# EAGLE design 44con2014 (EAGLE 6.5.0)
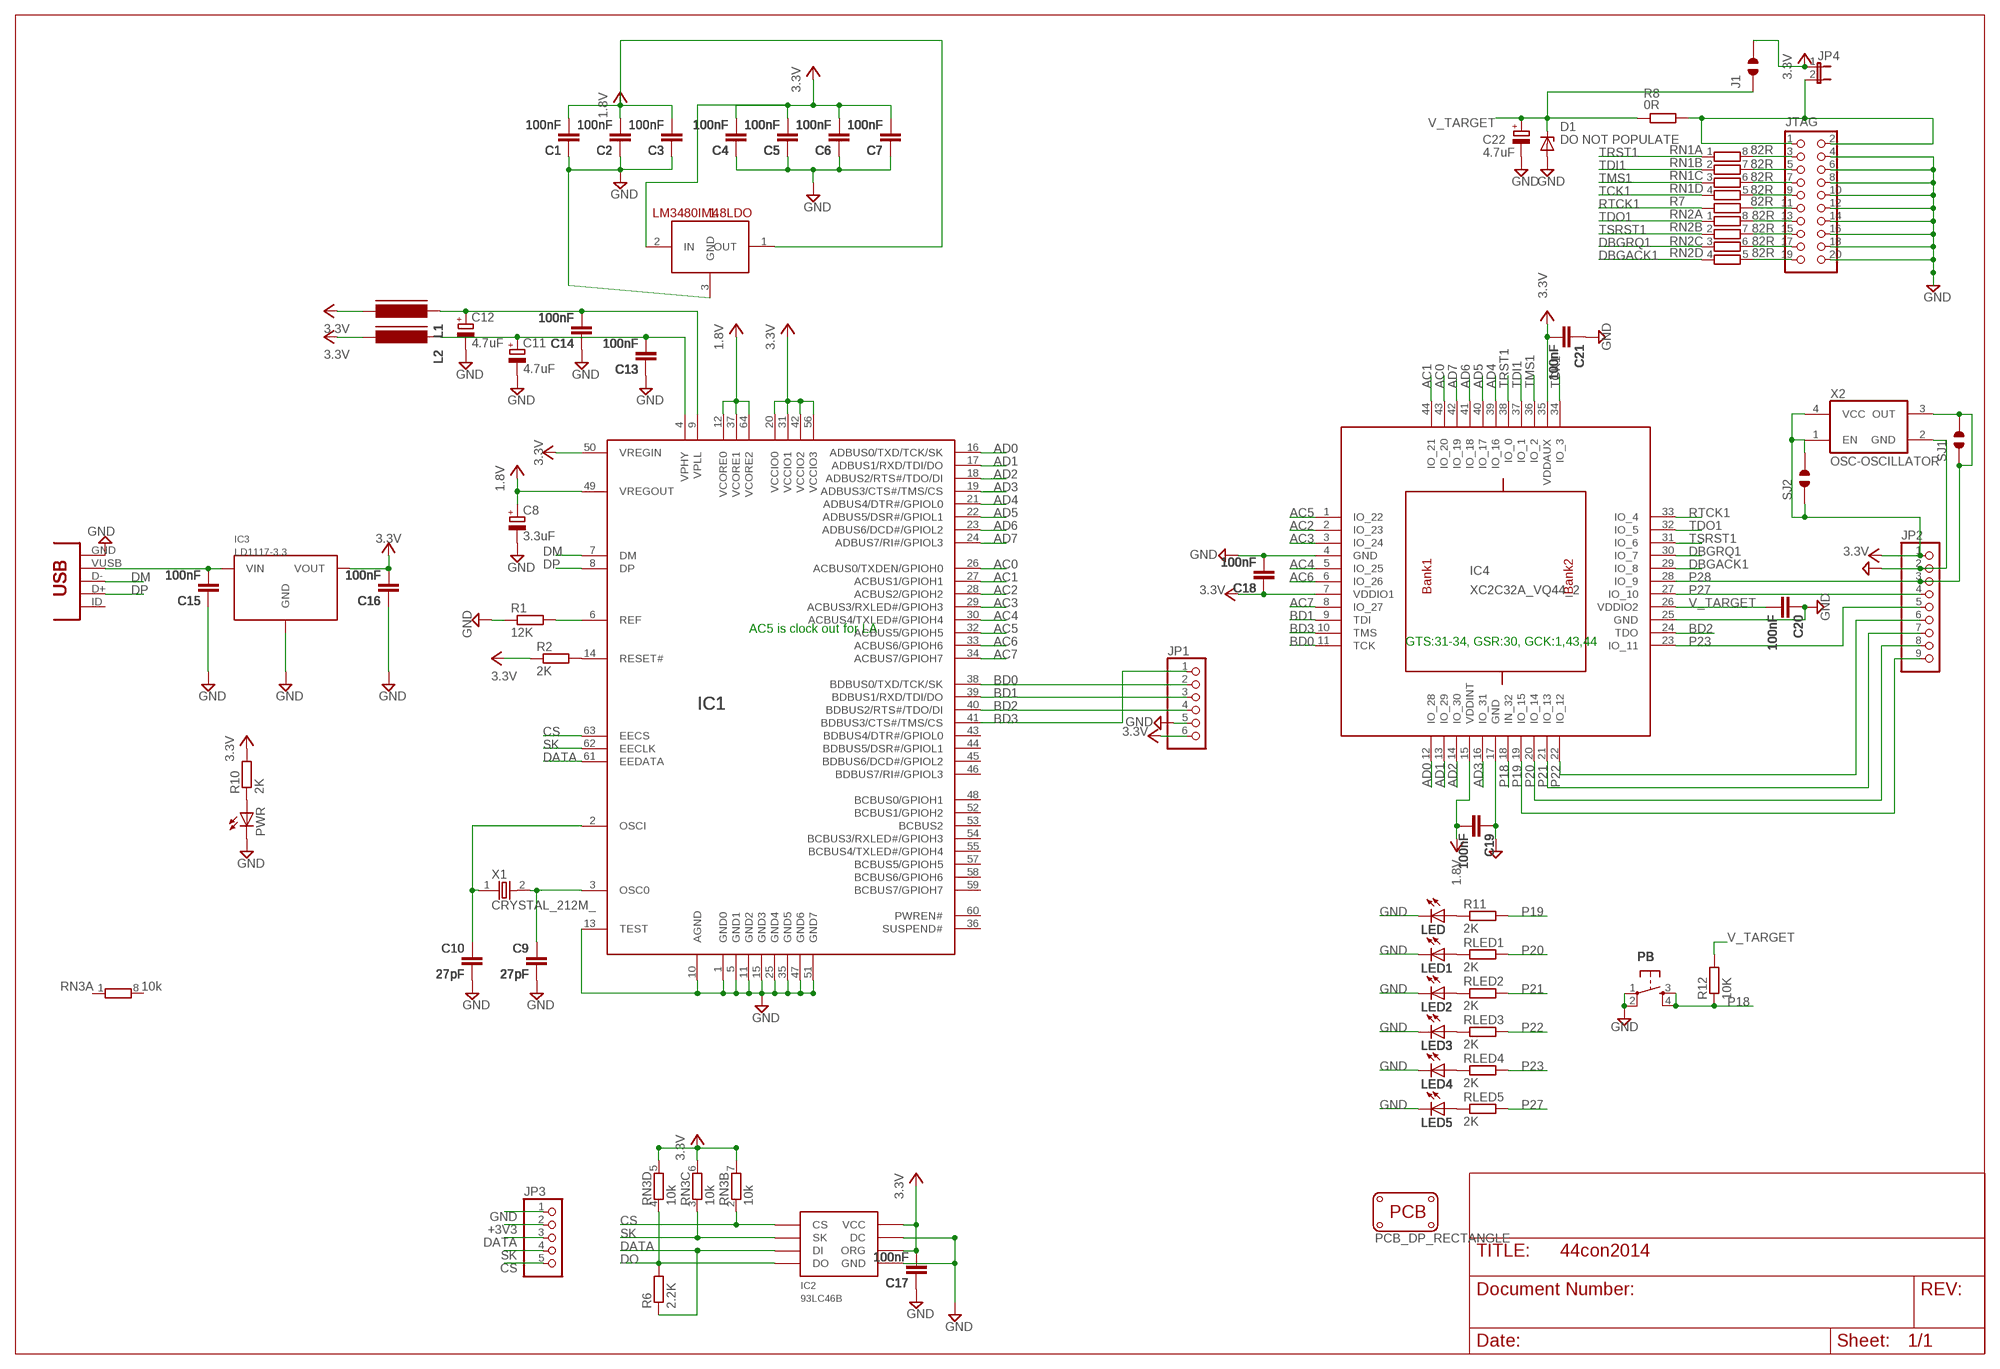
[diagram p0: schematic, sheet 1]

## Parts
1.8LDO  LM3480IM4  [SOT23-3]
C1  100nF  CAPC603  [C603]
C2  100nF  CAPC603  [C603]
C3  100nF  CAPC603  [C603]
C4  100nF  CAPC603  [C603]
C5  100nF  CAPC603  [C603]
C6  100nF  CAPC603  [C603]
C7  100nF  CAPC603  [C603]
C8  3.3uF  CAP_POLSMC_A  [SMC_A]
C9  27pF  CAPC603  [C603]
C10  27pF  CAPC603  [C603]
C11  4.7uF  CAP_POLSMC_A  [SMC_A]
C12  4.7uF  CAP_POLSMC_A  [SMC_A]
C13  100nF  CAPC603  [C603]
C14  100nF  CAPC603  [C603]
C15  100nF  CAPC603  [C603]
C16  100nF  CAPC603  [C603]
C17  100nF  CAPC603  [C603]
C18  100nF  CAPC603  [C603]
C19  100nF  CAPC603  [C603]
C20  100nF  CAPC603  [C603]
C21  100nF  CAPC603  [C603]
C22  4.7uF  CAP_POLSMC_A  [SMC_A]
D1  DO NOT POPULATE  ZENERSOD-123  [SOD-123]
IC1  FT2232H  [LQFP64]
IC2  93LC46B  93C46  [SOIC8]
IC3  LD1117-3.3  [SOT223]
IC4  XC2C32A_VQ44_2  [VQ44]
J1  JUMPER_SOLDER_1X2  [JUMPER_SOLDER_1X2]
JP1  PINHD-1X6  [1X06]
JP2  PINHD-1X9  [1X09]
JP3  PINHD-1X5  [1X05]
JP4  JP1EJP  [1X02]
JTAG  CON_HEADER_2X10-SHROUDED  [PINSHRD_PTH_2X10]
L1  FERRITE_BEAD603  [FB603]
L2  FERRITE_BEAD603  [FB603]
LED  LED805  [LED-805]
LED1  LED805  [LED-805]
LED2  LED805  [LED-805]
LED3  LED805  [LED-805]
LED4  LED805  [LED-805]
LED5  LED805  [LED-805]
PB  SW-SMD-SMALL  [TACT_SWITCH_SMALL]
PCB3  PCB_DP_RECTANGLE  [44CON2014]
PWR  LEDCHIPLED_0805  [CHIPLED_0805]
R1  12K  RESISTORR603  [R603]
R2  2K  RESISTORR603  [R603]
R6  2.2K  RESISTORR603  [R603]
R7  82R  RESISTORR603  [R603]
R8  0R  RESISTORR1206  [R1206]
R10  2K  RESISTORR603  [R603]
R11  2K  RESISTORR603  [R603]
R12  10K  RESISTORR603  [R603]
RLED1  2K  RESISTORR603  [R603]
RLED2  2K  RESISTORR603  [R603]
RLED3  2K  RESISTORR603  [R603]
RLED4  2K  RESISTORR603  [R603]
RLED5  2K  RESISTORR603  [R603]
RN1  82R  RNETWORK  [RN8P-4R-CRA06S]
RN2  82R  RNETWORK  [RN8P-4R-CRA06S]
RN3  10k  RNETWORK  [RN8P-4R-CRA06S]
SJ1  JUMPER_SOLDER_1X2  [JUMPER_SOLDER_1X2]
SJ2  JUMPER_SOLDER_1X2  [JUMPER_SOLDER_1X2]
USB  CON-USB-MINI-BUSB1  [CONN_USB_MINI-B]
X1  CRYSTAL_212M_  OSC-XTAL-12M  [XTAL_4X6]
X2  OSC-OSCILLATOR  [OSCILLATOR_7X5_SMD]

## Nets
1.8V: 1.8LDO.1(OUT) C1.2 C2.2 C3.2 C8.+ C19.2 IC1.12(VCORE0) IC1.37(VCORE1) IC1.49(VREGOUT) IC1.64(VCORE2) IC4.15(VDDINT)
+3V3: 1.8LDO.2(IN) C4.2 C5.2 C6.2 C7.2 C16.2 C17.2 C18.1 C21.2 IC1.20(VCCIO0) IC1.31(VCCIO1) IC1.42(VCCIO2) IC1.50(VREGIN) IC1.56(VCCIO3) IC2.6(ORG) IC2.8(VCC) IC3.2(VOUT) IC4.7(VDDIO1) IC4.35(VDDAUX) J1.2 JP1.6 JP2.1 JP3.2 JP4.1 L1.2 L2.2 R2.1 R10.2 RN3.5 RN3.6 RN3.7 SJ2.1 SJ2.2 X2.1(EN) X2.4(VCC) ; supply symbol labelled 3.3V
AC0: IC1.26(ACBUS0/TXDEN/GPIOH0) IC4.43(IO_20)
AC1: IC1.27(ACBUS1/GPIOH1) IC4.44(IO_21)
AC2: IC1.28(ACBUS2/GPIOH2) IC4.2(IO_23)
AC3: IC1.29(ACBUS3/RXLED#/GPIOH3) IC4.3(IO_24)
AC4: IC1.30(ACBUS4/TXLED#/GPIOH4) IC4.5(IO_25)
AC5: IC1.32(ACBUS5/GPIOH5) IC4.1(IO_22)
AC6: IC1.33(ACBUS6/GPIOH6) IC4.6(IO_26)
AC7: IC1.34(ACBUS7/GPIOH7) IC4.8(IO_27)
AD0: IC1.16(ADBUS0/TXD/TCK/SK) IC4.12(IO_28)
AD1: IC1.17(ADBUS1/RXD/TDI/DO) IC4.13(IO_29)
AD2: IC1.18(ADBUS2/RTS#/TDO/DI) IC4.14(IO_30)
AD3: IC1.19(ADBUS3/CTS#/TMS/CS) IC4.16(IO_31)
AD4: IC1.21(ADBUS4/DTR#/GPIOL0) IC4.39(IO_16)
AD5: IC1.22(ADBUS5/DSR#/GPIOL1) IC4.40(IO_17)
AD6: IC1.23(ADBUS6/DCD#/GPIOL2) IC4.41(IO_18)
AD7: IC1.24(ADBUS7/RI#/GPIOL3) IC4.42(IO_19)
BD0: IC1.38(BDBUS0/TXD/TCK/SK) IC4.11(TCK) JP1.2
BD1: IC1.39(BDBUS1/RXD/TDI/DO) IC4.9(TDI) JP1.3
BD2: IC1.40(BDBUS2/RTS#/TDO/DI) IC4.24(TDO) JP1.4
BD3: IC1.41(BDBUS3/CTS#/TMS/CS) IC4.10(TMS) JP1.1
CS: IC1.63(EECS) IC2.1(CS) JP3.5 RN3.2
DATA: IC1.61(EEDATA) IC2.3(DI) JP3.3 R6.1
DBGACK1: IC4.29(IO_8) RN2.4
DBGRQ1: IC4.30(IO_7) RN2.3
DM: IC1.7(DM) USB.D-
DO: IC2.4(DO) R6.2 RN3.4
DP: IC1.8(DP) USB.D+
GND: 1.8LDO.3(GND) C1.1 C2.1 C3.1 C4.1 C5.1 C6.1 C7.1 C8.- C9.2 C10.2 C11.- C12.- C13.1 C14.1 C15.1 C16.1 C17.1 C18.2 C19.1 C20.1 C21.1 C22.- D1.A IC1.1(GND0) IC1.5(GND1) IC1.10(AGND) IC1.11(GND2) IC1.13(TEST) IC1.15(GND3) IC1.25(GND4) IC1.35(GND5) IC1.47(GND6) IC1.51(GND7) IC2.5(GND) IC2.7(DC) IC3.1(GND) IC4.4(GND) IC4.17(GND) IC4.25(GND) JP1.5 JP2.2 JP3.1 JTAG.4 JTAG.6 JTAG.8 JTAG.10 JTAG.12 JTAG.14 JTAG.16 JTAG.18 JTAG.20 LED1.C LED2.C LED3.C LED4.C LED5.C LED.C PB.1 PB.2 PWR.C R1.1 USB.GND X2.2(GND)
N$1: C9.1 IC1.3(OSC0) X1.2
N$2: C10.1 IC1.2(OSCI) X1.1
N$3: IC1.14(RESET#) R2.2
N$4: IC1.6(REF) R1.2
N$5: C15.2 IC3.3(VIN) USB.VUSB
N$6: PWR.A R10.1
N$7: JTAG.3 RN1.8
N$8: LED.A R11.1
N$9: JTAG.5 RN1.7
N$10: JTAG.7 RN1.6
N$11: JTAG.9 RN1.5
N$12: JTAG.11 R7.2
N$13: JTAG.13 RN2.8
N$14: JTAG.15 RN2.7
N$15: JTAG.17 RN2.6
N$16: JTAG.19 RN2.5
N$22: LED1.A RLED1.1
N$23: LED2.A RLED2.1
N$24: LED3.A RLED3.1
N$25: LED4.A RLED4.1
N$26: LED5.A RLED5.1
P18: IC4.18(IN_32) PB.3 PB.4 R12.1
P19: IC4.19(IO_15) JP2.9 R11.2
P20: IC4.20(IO_14) JP2.8 RLED1.2
P21: IC4.21(IO_13) JP2.7 RLED2.2
P22: IC4.22(IO_12) JP2.6 RLED3.2
P23: IC4.23(IO_11) JP2.5 RLED4.2
P27: IC4.27(IO_10) JP2.4 RLED5.2
P28: IC4.28(IO_9) JP2.3 SJ1.1 SJ1.2 X2.3(OUT)
RTCK1: IC4.33(IO_4) R7.1
SK: IC1.62(EECLK) IC2.2(SK) JP3.4 RN3.3
TCK1: IC4.34(IO_3) RN1.4
TDI1: IC4.37(IO_1) RN1.2
TDO1: IC4.32(IO_5) RN2.1
TMS1: IC4.36(IO_2) RN1.3
TRST1: IC4.38(IO_0) RN1.1
TSRST1: IC4.31(IO_6) RN2.2
V_TARGET: C20.2 C22.+ D1.C IC4.26(VDDIO2) J1.1 R8.1 R12.2
V_TARGET_UNREG: JP4.2 JTAG.1 JTAG.2 R8.2
VPHY: C11.+ C13.2 IC1.4(VPHY) L2.1
VPLL: C12.+ C14.2 IC1.9(VPLL) L1.1
Unconnected: IC1.36(SUSPEND#) IC1.43(BDBUS4/DTR#/GPIOL0) IC1.44(BDBUS5/DSR#/GPIOL1) IC1.45(BDBUS6/DCD#/GPIOL2) IC1.46(BDBUS7/RI#/GPIOL3) IC1.48(BCBUS0/GPIOH1) IC1.52(BCBUS1/GPIOH2) IC1.53(BCBUS2) IC1.54(BCBUS3/RXLED#/GPIOH3) IC1.55(BCBUS4/TXLED#/GPIOH4) IC1.57(BCBUS5/GPIOH5) IC1.58(BCBUS6/GPIOH6) IC1.59(BCBUS7/GPIOH7) IC1.60(PWREN#) RN3.1 RN3.8 USB.BODY@1(BODY) USB.BODY@2(BODY) USB.BODY@3(BODY) USB.BODY@4(BODY) USB.ID(USBID)

## Notes on the sheet
- AC5 is clock out for LA
- GTS:31-34, GSR:30, GCK:1,43,44

## Library data of the parts
1.8LDO = SparkFun-PowerIC:LM3480IM4: Small package linear regulator
C1-C7 C9 C10 C13-C21 = dp_devices:CAP
C8 C11 C12 C22 = DP-EagleLibrary:CAP_POL
D1 = dp_devices:ZENER: Zener Diode SOD-323
IC1 = dp_devices:FT2232H: DUAL HIGH SPEED USB TO MULTIPURPOSE UART/FIFO IC
IC2 = DP-EagleLibrary:93C46
IC3 = DP-EagleLibrary:LD1117-3.3
IC4 = dp_devices:XC2C32A_VQ44_2: xc2c32a_vq44-ian edit this description Auto generated by make-symbol-device-package-bsdl.ulp Rev. 29 Source: xc2c32a_vq44-ian.bsd
J1 SJ1 SJ2 = dp_devices:JUMPER_SOLDER_1X2
JP1 = pinhead:PINHD-1X6: PIN HEADER
JP2 = pinhead - Copy:PINHD-1X9: PIN HEADER
JP3 = pinhead:PINHD-1X5: PIN HEADER
JP4 = jumper:JP1E: JUMPER
JTAG = dp_devices:CON_HEADER_2X10
L1 L2 = dp_devices:FERRITE_BEAD
LED LED1-LED5 = dp_devices:LED
PB = dp_devices:SW-SMD-SMALL
PCB3 = dp_pcb:PCB_DP_RECTANGLE: Dangerous Prototypes Standard Rectangular PCB sizes
PWR = led:LED: LED OSRAM: - CHIPLED LG R971, LG N971, LY N971, LG Q971, LY Q971, LO R971, LY R971 LH N974, LH R974 LS Q976, LO Q976, LY Q976 LO Q996 - Hyper CHIPLED LW Q18S LB Q993, LB Q99A, LB R99A - SideLED LS A670, LO A670, LY A670, LG A670, LP A670 LB A673, LV A673, LT A673, LW A673 LH A674 LY A675 LS A676, LA A676, LO A676, LY A676, LW A676 LS A679, LY A679, LG A679 - Hyper Micro SIDELED® LS Y876, LA Y876, LO Y876, LY Y876 LT Y87S - SmartLED LW L88C, LW L88S LB L89C, LB L89S, LG L890 LS L89K, LO L89K, LY L89K LS L896, LA L896, LO L896, LY L896 - TOPLED LS T670, LO T670, LY T670, LG T670, LP T670 LSG T670, LSP T670, LSY T670, LOP T670, LYG T670 LG T671, LOG T671, LSG T671 LB T673, LV T673, LT T673, LW T673 LH T674 LS T676, LA T676, LO T676, LY T676, LB T676, LH T676, LSB T676, LW T676 LB T67C, LV T67C, LT T67C, LS T67K, LO T67K, LY T67K, LW E67C LS E67B, LA E67B, LO E67B, LY E67B, LB E67C, LV E67C, LT E67C LW T67C LS T679, LY T679, LG T679 LS T770, LO T770, LY T770, LG T770, LP T770 LB T773, LV T773, LT T773, LW T773 LH T774 LS E675, LA E675, LY E675, LS T675 LS T776, LA T776, LO T776, LY T776, LB T776 LHGB T686 LT T68C, LB T68C - Hyper Mini TOPLED® LB M676 - Mini TOPLED Santana® LG M470 LS M47K, LO M47K, LY M47K Source: http://www.osram.convergy.de LUXEON: - LUMILED® LXK2-PW12-R00, LXK2-PW12-S00, LXK2-PW14-U00, LXK2-PW14-V00 LXK2-PM12-R00, LXK2-PM12-S00, LXK2-PM14-U00 LXK2-PE12-Q00, LXK2-PE12-R00, LXK2-PE12-S00, LXK2-PE14-T00, LXK2-PE14-U00 LXK2-PB12-K00, LXK2-PB12-L00, LXK2-PB12-M00, LXK2-PB14-N00, LXK2-PB14-P00, LXK2-PB14-Q00 LXK2-PR12-L00, LXK2-PR12-M00, LXK2-PR14-Q00, LXK2-PR14-R00 LXK2-PD12-Q00, LXK2-PD12-R00, LXK2-PD12-S00 LXK2-PH12-R00, LXK2-PH12-S00 LXK2-PL12-P00, LXK2-PL12-Q00, LXK2-PL12-R00 Source: www.luxeon.com KINGBRIGHT: KA-3528ASYC Source: www.kingbright.com
R1 R2 R6-R8 R10-R12 RLED1-RLED5 = dp_devices:RESISTOR
RN1-RN3 = dp_devices:RNETWORK: 4 Resistor Array 0603
USB = dp_devices:CON-USB-MINI-B: USB connector
X1 = dp_devices:OSC-XTAL
X2 = dp_devices:OSC-OSCILLATOR: Oscillator

## Board
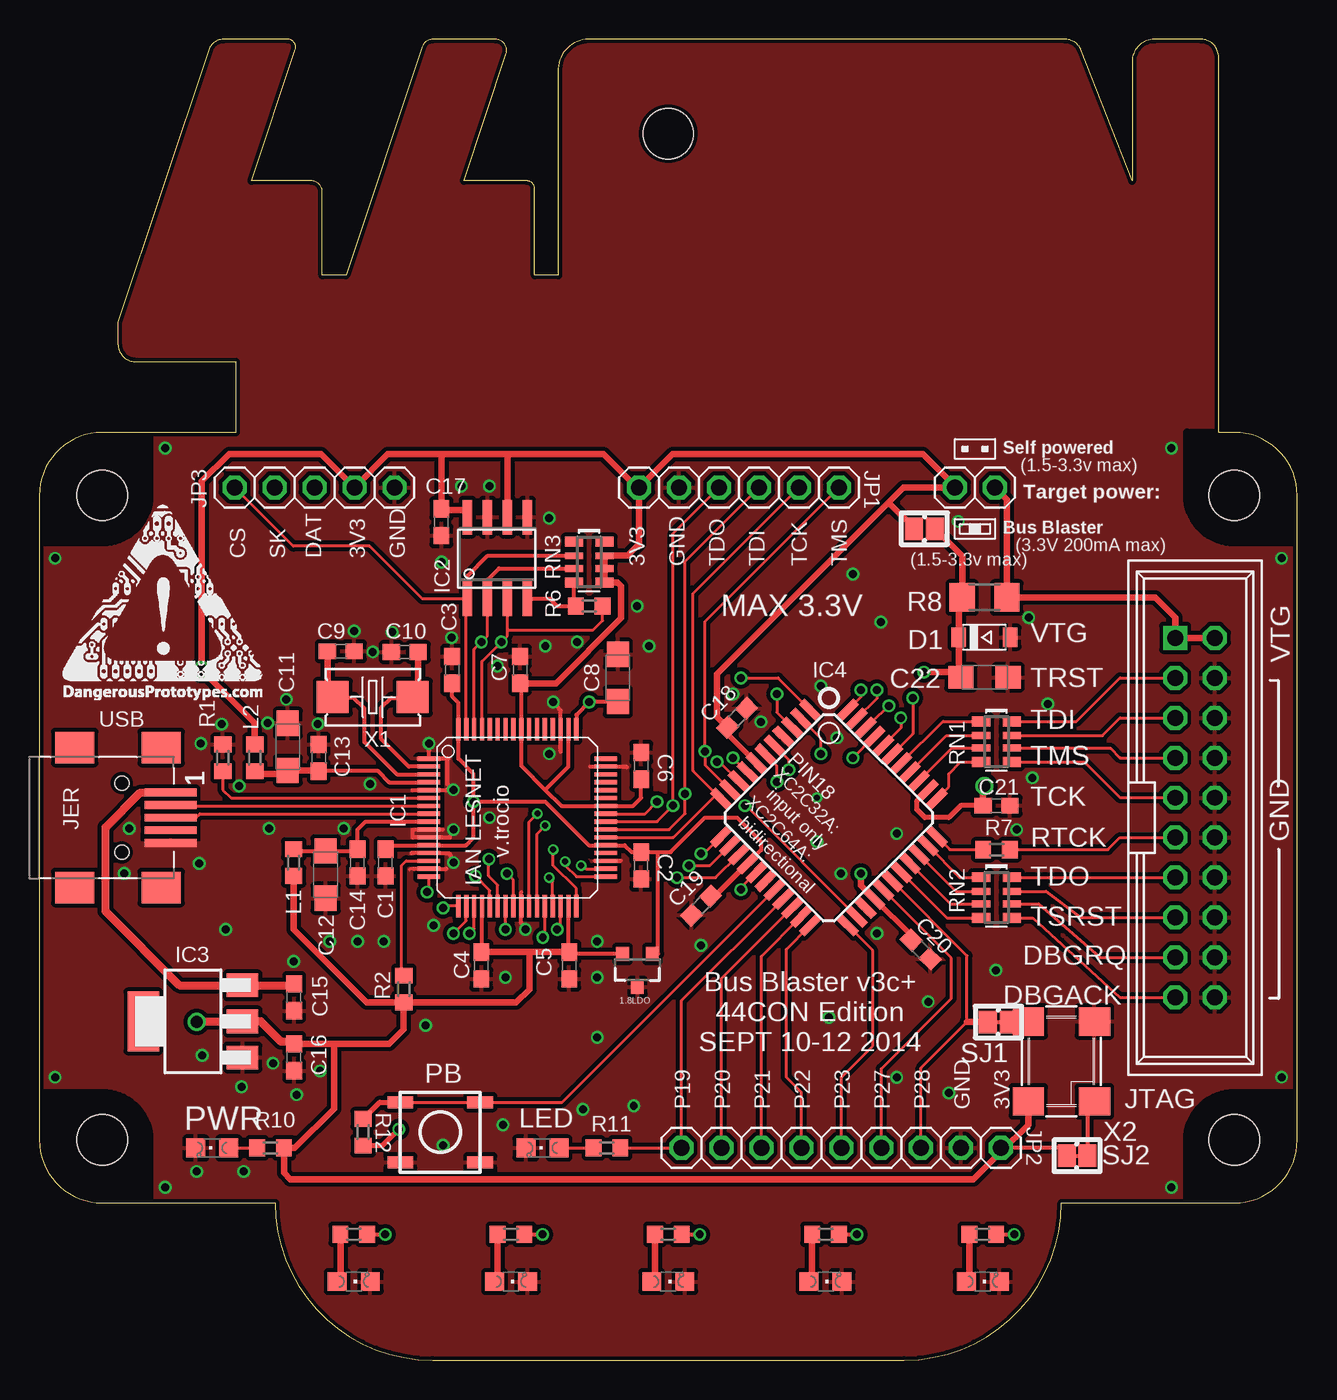
[diagram p1: board, top side]
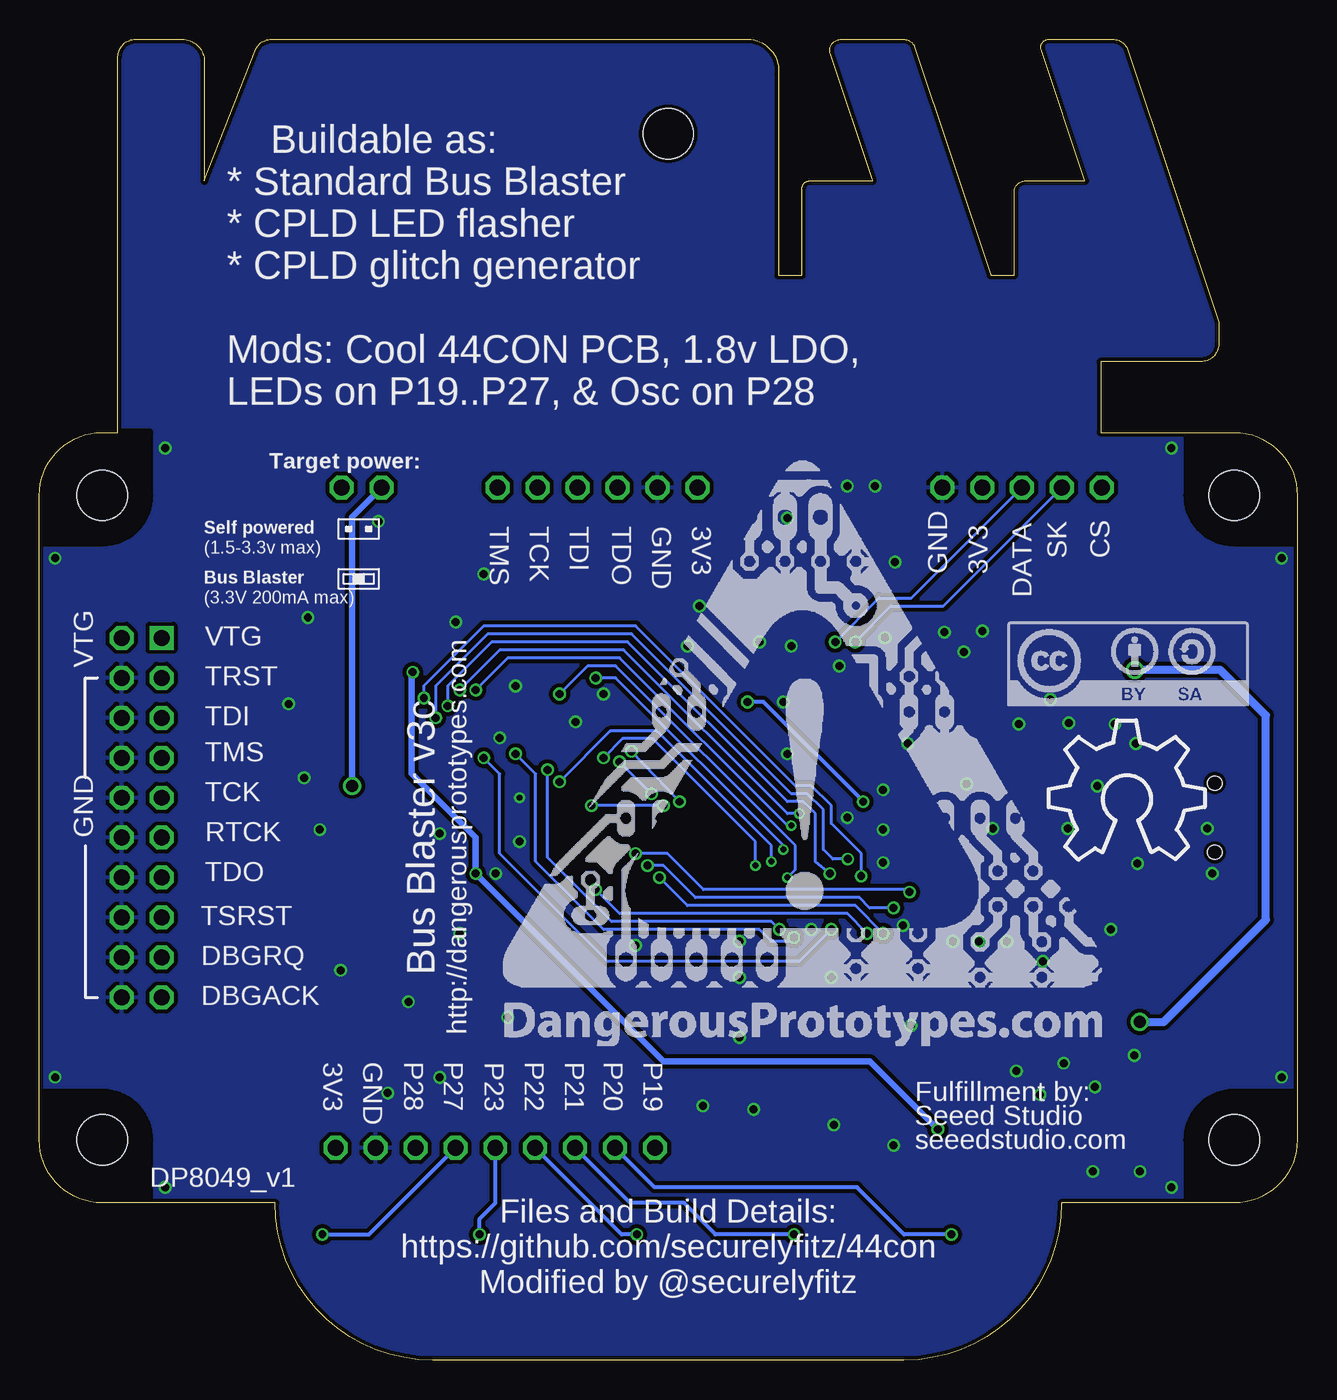
[diagram p2: board, bottom side, seen from below]

Size 80 x 84 mm. Coordinates in mm from the lower left corner, seen from the top.
Copper layers (1*16): Top 0.035mm / dielectric 1.5mm / Bottom 0.035mm
Design rules "Fusion_eagle_rule_v1.1": minimum track width 6mil, minimum drill 12mil, track to track 6mil, track to pad 6mil, pad to pad 6mil, via to via 6mil, smd to smd 0mil, copper to edge 10mil, drill to drill 10mil, minimum pad ring 10mil, minimum via ring 6mil, stop-mask expansion 2mil, vias tented up to drill 100mil, thermal gap 10mil
Holes 3.2 mm at 40,78

### Footprints (pad centres in the part's own frame; a part is rotated, then mirrored left to right if it is on the bottom)
SOT23-3 = smd 0.8 x 0.9: 1 -0.95,-1; 2 0.95,-1; 3 0,1.1
C603 = smd 1.1 x 1: 1 -0.85,0; 2 0.85,0
SMC_A = smd 1.6 x 1.4: + -1.5,0; - 1.5,0
SOD-123 = smd 0.91 x 1.22: A 1.635,0; C -1.635,0
LQFP64 = smd 1.45 x 0.27: 1 -5.625,3.75; 2 -5.625,3.25; 3 -5.625,2.75; 4 -5.625,2.25; 5 -5.625,1.75; 6 -5.625,1.25; 7 -5.625,0.75; 8 -5.625,0.25; 9 -5.625,-0.25; 10 -5.625,-0.75; 11 -5.625,-1.25; 12 -5.625,-1.75; 13 -5.625,-2.25; 14 -5.625,-2.75; 15 -5.625,-3.25; 16 -5.625,-3.75; 33 5.625,-3.75; 34 5.625,-3.25; 35 5.625,-2.75; 36 5.625,-2.25; 37 5.625,-1.75; 38 5.625,-1.25; 39 5.625,-0.75; 40 5.625,-0.25; 41 5.625,0.25; 42 5.625,0.75; 43 5.625,1.25; 44 5.625,1.75; 45 5.625,2.25; 46 5.625,2.75; 47 5.625,3.25; 48 5.625,3.75 | smd 0.27 x 1.45: 17 -3.75,-5.625; 18 -3.25,-5.625; 19 -2.75,-5.625; 20 -2.25,-5.625; 21 -1.75,-5.625; 22 -1.25,-5.625; 23 -0.75,-5.625; 24 -0.25,-5.625; 25 0.25,-5.625; 26 0.75,-5.625; 27 1.25,-5.625; 28 1.75,-5.625; 29 2.25,-5.625; 30 2.75,-5.625; 31 3.25,-5.625; 32 3.75,-5.625; 49 3.75,5.625; 50 3.25,5.625; 51 2.75,5.625; 52 2.25,5.625; 53 1.75,5.625; 54 1.25,5.625; 55 0.75,5.625; 56 0.25,5.625; 57 -0.25,5.625; 58 -0.75,5.625; 59 -1.25,5.625; 60 -1.75,5.625; 61 -2.25,5.625; 62 -2.75,5.625; 63 -3.25,5.625; 64 -3.75,5.625
SOIC8 = smd 0.6 x 2.2: 1 -1.905,-2.6; 2 -0.635,-2.6; 3 0.635,-2.6; 4 1.905,-2.6; 5 1.905,2.6; 6 0.635,2.6; 7 -0.635,2.6; 8 -1.905,2.6
SOT223 = smd 1.5 x 2: 1 -2.3,-3.15; 2 0,-3.15; 3 2.3,-3.15 | smd 3.8 x 2: 4 0,3.15
VQ44 = smd 1.5 x 0.5: 1 -5.7,4; 2 -5.7,3.2; 3 -5.7,2.4; 4 -5.7,1.6; 5 -5.7,0.8; 6 -5.7,0; 7 -5.7,-0.8; 8 -5.7,-1.6; 9 -5.7,-2.4; 10 -5.7,-3.2; 11 -5.7,-4; 23 5.7,-4; 24 5.7,-3.2; 25 5.7,-2.4; 26 5.7,-1.6; 27 5.7,-0.8; 28 5.7,0; 29 5.7,0.8; 30 5.7,1.6; 31 5.7,2.4; 32 5.7,3.2; 33 5.7,4 | smd 0.5 x 1.5: 12 -4,-5.7; 13 -3.2,-5.7; 14 -2.4,-5.7; 15 -1.6,-5.7; 16 -0.8,-5.7; 17 0,-5.7; 18 0.8,-5.7; 19 1.6,-5.7; 20 2.4,-5.7; 21 3.2,-5.7; 22 4,-5.7; 34 4,5.7; 35 3.2,5.7; 36 2.4,5.7; 37 1.6,5.7; 38 0.8,5.7; 39 0,5.7; 40 -0.8,5.7; 41 -1.6,5.7; 42 -2.4,5.7; 43 -3.2,5.7; 44 -4,5.7
JUMPER_SOLDER_1X2 = smd 1.143 x 1.422: 1 -0.66,0; 2 0.66,0
1X06 = drill 1.016 octagon: 1 -6.35,0; 2 -3.81,0; 3 -1.27,0; 4 1.27,0; 5 3.81,0; 6 6.35,0
1X09 = drill 1.016 octagon: 1 -10.16,0; 2 -7.62,0; 3 -5.08,0; 4 -2.54,0; 5 0,0; 6 2.54,0; 7 5.08,0; 8 7.62,0; 9 10.16,0
1X05 = drill 1.016 octagon: 1 -5.08,0; 2 -2.54,0; 3 0,0; 4 2.54,0; 5 5.08,0
1X02 = drill 1.016 octagon: 1 -1.27,0; 2 1.27,0
PINSHRD_PTH_2X10 = drill 1.016 square: 1 -11.43,-1.27 | drill 1.016 octagon: 2 -11.43,1.27; 3 -8.89,-1.27; 4 -8.89,1.27; 5 -6.35,-1.27; 6 -6.35,1.27; 7 -3.81,-1.27; 8 -3.81,1.27; 9 -1.27,-1.27; 10 -1.27,1.27; 11 1.27,-1.27; 12 1.27,1.27; 13 3.81,-1.27; 14 3.81,1.27; 15 6.35,-1.27; 16 6.35,1.27; 17 8.89,-1.27; 18 8.89,1.27; 19 11.43,-1.27; 20 11.43,1.27
FB603 = smd 1 x 1.1: 1 -0.85,0; 2 0.85,0
LED-805 = smd 1.2 x 1.2: A 0,-1.05; C 0,1.05
TACT_SWITCH_SMALL = smd 1.651 x 0.762: 1 -2.54,1.905; 2 2.54,1.905; 3 -2.54,-1.905; 4 2.54,-1.905
44CON2014 = hole 3.2: 4,4; 76,4; 76,45; 4,45
CHIPLED_0805 = smd 1.2 x 1.2: A 0,-1.05; C 0,1.05
R603 = smd 1 x 1.1: 1 -0.85,0; 2 0.85,0
R1206 = smd 1.6 x 1.803: 1 -1.422,0; 2 1.422,0
RN8P-4R-CRA06S = smd 0.63 x 1.15: 1 -1.295,-0.975; 4 1.295,-0.975; 5 1.295,0.975; 8 -1.295,0.975 | smd 0.44 x 1.15: 2 -0.4,-0.975; 3 0.4,-0.975; 6 0.4,0.975; 7 -0.4,0.975
CONN_USB_MINI-B = smd 2 x 2.5: BODY@1 -4.45,2.5; BODY@2 4.45,2.5; BODY@3 4.45,-3; BODY@4 -4.45,-3 | smd 0.5 x 3.3: D+ 0,3.1; D- -0.8,3.1; GND 1.6,3.1; ID 0.8,3.1; VUSB -1.6,3.1 | hole 0.9: -2.2,0; 2.2,0
XTAL_4X6 = smd 2.032 x 2.032: 1 -2.54,0; 2 2.54,0
OSCILLATOR_7X5_SMD = smd 1.8 x 2: 1 -2.54,-2.1; 2 2.54,-2.1; 3 2.54,2.1; 4 -2.54,2.1

### Placement (x,y rotation side)
1.8LDO  38.04,24.84 180 top
C1  22.02,31.64 90 top
C2  38.27,31.46 90 top
C3  26.26,43.9 270 top
C4  28.11,25.1 90 top
C5  33.7,25.1 90 top
C6  38.27,37.8 270 top
C7  30.57,43.9 270 top
C8  36.8,43.39 90 top
C9  19.18,45.09 0 top
C10  23.24,45.04 180 top
C11  15.8,39.01 90 top
C12  18.21,30.88 270 top
C13  17.77,38.31 270 top
C14  20.24,31.64 90 top
C15  16.21,23.07 90 top
C16  16.21,19.26 90 top
C17  25.57,53.3 90 top
C18  44.37,40.85 45 top
C19  42.08,28.91 45 top
C20  56.05,26.12 135 top
C21  60.87,35.26 180 top
C22  60.11,43.43 0 top
D1  60.11,45.97 0 top
IC1  30.4,34.5 0 top
IC2  29.13,51.01 0 top
IC3  9.77,21.55 90 top
IC4  50.21,34.5 315 top
J1  56.28,52.88 180 top
JP1  44.5,55.5 180 top
JP2  51,13.5 180 top
JP3  17.5,55.5 180 top
JP4  59.5,55.5 0 top
JTAG  73.5,34.5 270 top
L1  16.18,31.64 270 top
L2  13.71,38.31 90 top
LED  32,13.5 90 top
LED1  20,5 270 top
LED2  30,5 270 top
LED3  40,5 270 top
LED4  50,5 270 top
LED5  60,5 270 top
PB  25.5,14.5 180 top
PCB3  0,10 0 top
PWR  11,13.5 90 top
R1  11.68,38.31 270 top
R2  23.18,23.6 90 top
R6  34.97,47.96 180 top
R7  60.87,32.47 0 top
R8  60.11,48.51 0 top
R10  14.7,13.5 0 top
R11  36.1,13.5 0 top
R12  20.59,14.5 270 top
RLED1  20,8 0 top
RLED2  30,8 0 top
RLED3  40,8 0 top
RLED4  50,8 0 top
RLED5  60,8 0 top
RN1  60.87,39.33 270 top
RN2  60.87,29.42 270 top
RN3  34.97,50.76 270 top
SJ1  61,21.5 0 top
SJ2  66,13 0 top
U$1  [DP_LOGO_ART_1.5X1.5]  50.5,20 0 bottom
U$2  [DP_LOGO_ART_0.5X0.5]  1.5,42 0 top
U$3  [CC-BY-SA]  18.42,41.63 0 bottom
U$4  [44CON]  5,59 0 top
U$5  [OSHW_10X350_NOTEXT]  15.8,31.82 0 bottom
U$6  adasdsd  [JUMP2_DESC_ON]  59.69,49.69 0 bottom
U$7  [JUMP2_DESC_OFF]  59.69,52.86 0 bottom
U$8  [JUMP2_DESC_OFF]  59.5,57.94 0 top
U$9  adasdsd  [JUMP2_DESC_ON]  59.5,52.86 0 top
U$10  [2014]  22.36,1.12 0 top
USB  5.25,34.5 270 top
X1  21.21,42.17 180 top
X2  65,19 90 top

### Tracks (layer width: path | path; a pad name or v marks a point on that pad's centre or on a via)
1.8V  (via drill 0.51)
  Top 0.254: C1.2 22.08,32.43 21.91,32.54 22.11,32.75 IC1.12 27.13,32.75 27.61,33.23 v27.61,35.52 | C3.2 26.26,42.2 26.65,41.81 IC1.64 26.65,38.25 27.61,37.29 v27.61,35.52 | v27.61,35.52 32.18,35.52 34.94,32.75 IC1.37 37.23,32.75 37.67,32.31 C2.2 39.36,32.31 | 39.36,32.31 40.14,32.31 42.34,34.5 44.37,34.5 45.89,32.98 45.89,32.45 IC4.15 | C8.+ 35,41.89 v34.97,41.87 34.15,41.04 IC1.49 | 1.8LDO.1 39.36,25.84 39.36,32.31
  Top 0.305: IC4.15 42.96,29.51 C19.2
  Bottom 0.254: v34.97,41.87 33.96,41.87 v27.61,35.52
+3V3  (via drill 0.76)
  Top 0.254: IC1.20 28.15,25.99 C4.2 | C7.2 30.65,42.97 IC1.56 30.65,37.81 32.18,36.28 | IC1.31 33.65,26 C5.2 33.7,25.84 1.8LDO.2 | C6.2 38.27,35.76 37.77,35.25 IC1.42 33.21,35.25 32.18,36.28 | IC1.50 33.65,37.75 32.18,36.28 | JP2.1 65.16,13.5 SJ2.1 SJ2.2 66.66,16.46 X2.1
  Top 0.305: 43.77,40.44 C18.1 43.77,39.81 IC4.7 | C21.2 58.59,35.26 57.83,34.5 56.31,34.5 55.8,35.01 55.8,35.56 IC4.35
  Top 0.406: IC2.8 27.23,53.93 27.1,54.06 25.66,54.06 C17.2 25.57,57.62 | C7.2 32.85,43.05 37,47.2 37,49.23 36.77,49.46 RN3.5 RN3.6 RN3.7 37.4,51.16 38.15,51.9 JP1.6 | L1.2 16.18,27.39 20.82,22.75 R2.1 | 31.16,25.95 C4.2 | 31.16,25.95 C5.2 | C18.1 43.1,40.92 43.1,43.64 54.01,54.55 | 31.16,25.95 31.16,23.58 30.33,22.75 R2.1 | v60.11,36.53 60.02,36.44 C21.2 | 16.12,20.12 16.14,20.11 18.75,20.11 | 18.75,20.11 18.75,16 16.24,13.49 R10.2 | 18.75,20.11 22.24,20.11 23.18,21.05 R2.1 | L2.2 13.71,40.52 v10.33,43.9 10.33,55.89 12.06,57.62 17.91,57.62 JP3.2 22.16,57.62 25.57,57.62 | JP1.6 40.27,57.62 56.2,57.62 58.23,55.59 JP4.1 54.96,55.5 54.01,54.55 | JP1.6 38,55.5 35.88,57.62 29.77,57.62 | 25.57,57.62 29.77,57.62 | 29.77,57.62 IC2.6 | 61.16,13.24 JP2.1 | 61.16,13.24 59.42,11.5 15.96,11.5 15.56,11.9 R10.2 | R10.2 | X2.4 62.9,14.98 61.16,13.24 | J1.2 55.62,52.94 54.01,54.55
  Top 0.508: 16.07,20.25 15.38,20.25 14.08,21.55 IC3.2 12.87,21.5 v10,21.5 | 16.07,20.25 C16.2 | 16.07,20.25 16.07,20.18 16.12,20.12
  Bottom 0.406: v60.11,36.53 60.11,53.62 JP4.1
  Bottom 0.508: v10.33,43.9 4.9,43.9 2,41 2,28 8.5,21.5 v10,21.5
AC0  (via drill 0.38, 0.51)
  Top 0.203: IC1.26 31.15,34.23 v31.67,34.75 | v53.26,42.63 53.26,42.07 IC4.43
  Bottom 0.203: v31.67,34.75 32.43,34.75 42.85,45.17 50.72,45.17 v53.26,42.63
AC1  (via drill 0.38, 0.51)
  Top 0.203: IC1.27 31.65,33.46 v32.18,33.99 | v52.24,42.63 52.24,42.19 IC4.44
  Bottom 0.203: v32.18,33.99 32.43,33.99 43.1,44.66 50.21,44.66 v52.24,42.63
AC2  (via drill 0.51)
  Top 0.203: v49.7,38.56 49.7,39.53 IC4.2 | IC1.28 32.15,27.01 v32.02,26.88
  Bottom 0.203: v49.7,38.56 48.43,37.29 48.43,31.71 44.12,27.39 34.21,27.39 33.45,26.63 32.27,26.63 v32.02,26.88
AC3  (via drill 0.38, 0.51)
  Top 0.203: IC1.29 32.65,30.47 v32.43,30.69 | v46.91,42.37 46.91,41.2 IC4.3
  Bottom 0.203: v32.43,30.69 31.92,31.2 31.92,32.72 43.35,44.15 45.13,44.15 v46.91,42.37
AC4  (via drill 0.51)
  Top 0.203: IC1.30 33.15,27.6 v32.94,27.39 | v47.67,37.55 47.67,38.17 IC4.5
  Bottom 0.203: v32.94,27.39 33.45,27.9 43.61,27.9 47.67,31.96 v47.67,37.55
AC5  (via drill 0.38, 0.51)
  Top 0.203: IC1.32 34.15,29.99 32.69,31.45 v32.69,32.47 | IC4.1 46.98,43.39 v44.62,43.39
  Bottom 0.203: v32.69,32.47 32.69,32.72 43.35,43.39 v44.62,43.39
AC6  (via drill 0.38, 0.51)
  Top 0.203: IC1.33 34.15,30.75 33.45,31.45 v33.45,31.71 | v46.91,36.79 46.91,37.8 IC4.6
  Bottom 0.203: v33.45,31.71 33.45,32.72 40.73,40 43.69,40 v46.91,36.79
AC7  (via drill 0.38, 0.51)
  Top 0.203: IC1.34 34.77,31.25 v34.46,31.45 | v44.12,38.31 45.03,37.4 IC4.8
  Bottom 0.203: v34.46,31.45 34.46,32.98 41.02,39.53 42.9,39.53 v44.12,38.31
AD0  (via drill 0.51)
  Top 0.203: v42.08,32.21 42.27,32.21 IC4.12 | IC1.16 24.77,29.89 v24.65,29.77
  Bottom 0.203: v42.08,32.21 40.05,32.21 37.77,29.93 24.81,29.93 v24.65,29.77
AD1  (via drill 0.51)
  Top 0.203: v41.32,31.45 42.64,31.45 IC4.13 | IC1.17 25.86,28.88 v25.67,28.75
  Bottom 0.203: v41.32,31.45 40.31,31.45 38.27,29.42 27.86,29.42 27.19,28.75 v25.67,28.75
AD2  (via drill 0.51)
  Top 0.203: v40.56,30.69 43.01,30.69 IC4.14 | IC1.18 27.15,27.95 v26.34,27.13
  Bottom 0.203: v26.34,27.13 28.11,28.91 38.78,28.91 v40.56,30.69
AD3  (via drill 0.51)
  Top 0.203: IC1.19 27.65,27.43 v27.35,27.13 | v44.62,29.93 44.51,29.93 IC4.16
  Bottom 0.203: v27.35,27.13 28.62,28.4 43.1,28.4 v44.62,29.93
AD4  (via drill 0.51)
  Top 0.203: v55.55,42.12 55.55,39.83 IC4.39 | IC1.21 28.65,29.87 v27.73,30.79
  Bottom 0.203: v55.55,42.12 55.55,42.88 51.74,46.69 42.08,46.69 31.92,36.53 30.91,36.53 29.64,35.26 29.64,34.13 27.73,32.23 v27.73,30.79
AD5  (via drill 0.51)
  Top 0.203: v54.78,40.85 54.78,40.2 IC4.40 | IC1.22 29.15,30.22 28.57,30.8 28.57,31.85 v28.59,31.86
  Bottom 0.203: v54.78,40.85 54.78,42.88 51.48,46.18 42.34,46.18 32.18,36.02 31.16,36.02 30.15,35.01 30.15,32.47 29.54,31.86 v28.59,31.86
AD6  (via drill 0.51)
  Top 0.203: IC1.23 v29.65,27.4 v29.64,27.39 | v51.74,38.31 53.09,39.66 IC4.41
  Bottom 0.203: v29.64,27.39 31.67,25.36 43.86,25.36 50.72,32.21 50.72,37.29 v51.74,38.31
AD7  (via drill 0.51)
  Top 0.203: 54.02,41.7 v54.02,41.61 IC4.42 | IC1.24 30.15,30.53 v29.73,30.94
  Bottom 0.203: v54.02,41.61 54.02,42.88 51.23,45.68 42.59,45.68 32.43,35.52 31.42,35.52 30.65,34.75 30.65,31.71 v29.73,30.94
BD0
  Top 0.203: IC1.38 40.33,33.25 42.97,35.9 | 42.97,35.9 43.1,36.02 | 42.97,35.9 43.17,35.7 IC4.11 41.58,37.48 41.58,48.77 JP1.2
BD1  (via drill 0.51)
  Top 0.203: IC1.39 40.05,33.75 41.07,34.77 v41.07,36.02 41.07,50.8 JP1.3 | IC4.9 43.26,38.06 v43.1,38.06
  Bottom 0.203: v41.07,36.02 v43.1,38.06
BD2  (via drill 0.51)
  Top 0.203: IC1.40 39.29,34.25 v40.31,35.27 | IC4.24 44.92,35.26 v44.88,35.26 | v40.31,35.27 v40.31,35.26 | v40.31,35.27 40.31,52.58 JP1.4
  Bottom 0.203: v40.31,35.26 v44.88,35.26
BD3  (via drill 0.51)
  Top 0.203: IC1.41 38.52,34.75 v39.29,35.52 | IC4.10 42.34,37.85 v42.34,38.72 42.34,46.99 JP1.1
  Bottom 0.203: 39.24,35.52 v39.29,35.52 v42.34,38.72
CS
  Top 0.203: IC1.63 27.15,48.34 IC2.1 24.36,48.41 21,51.77 16.15,51.77 JP3.5
  Top 0.254: RN3.2 28.51,51.16 27.23,49.87 IC2.1
DATA  (via drill 0.51)
  Top 0.203: IC1.61 28.15,44.44 v29.38,45.68 29.77,46.06 29.77,46.44 | 29.77,46.44 IC2.3 | R6.1 35.82,47.03 35.23,46.44 29.77,46.44
  Bottom 0.203: v29.38,45.68 26.59,48.47 24.53,48.47 JP3.3
DBGACK1
  Top 0.203: IC4.29 57.72,28.12 RN2.4
DBGRQ1
  Top 0.203: IC4.30 57.95,29.02 RN2.3
DM
  Top 0.203: IC1.7 8.23,35.25 USB.D-
DO
  Top 0.254: RN3.4 34,48.09 R6.2 32.94,47.96 32.49,48.41 IC2.4
DP
  Top 0.203: IC1.8 10.23,34.75 9.98,34.5 USB.D+
GND  (via drill 0.38, 0.51)
  Top 0.203: 30.65,27.84 30.66,27.84 | 23.8,31.25 23.6,31.25 23.54,31.2 | 30.7,27.75 30.7,27.43 v30.91,27.39
  Top 0.254: 30.65,29.42 30.65,27.84 30.65,27.8 30.7,27.75 | 30.65,29.42 30.65,29.76 | IC1.15 23.8,31.25 | 25.32,32.24 23.65,32.24 | 25.66,33.24 23.74,33.24 23.73,33.25 23.73,33.74 25.65,33.74 | 23.72,36.24 25.64,36.24 25.63,36.25 | 35.05,37.74 36.03,37.74 | 35.32,31.75 36.98,31.75 | 24.1,38.25 26.02,38.25 | IC1.5 25.63,36.25 | 24.81,38.78 24.77,38.75 IC1.1 25.95,38.25 25.96,38.26 25.96,36.63 26.12,36.47 25.9,36.25 25.63,36.25 | IC1.51 33.15,39.22 33.16,38.71 33.16,41.32 v32.69,41.87 | 36.03,37.74 IC1.47 | 36.03,37.74 37.33,37.74 37.37,37.7 | IC1.11 25.64,33.25 25.66,33.24 | IC1.13 25.31,32.25 25.32,32.24 | IC1.15 | 25.66,33.24 25.9,33.24 | 25.9,33.24 25.91,33.23 | IC1.15 25.89,31.25 25.9,31.27 | IC1.25 30.65,29.42 | 36.98,31.75 IC1.35 | 36.98,31.75 | 25.32,32.24 26.05,32.24 v26.34,31.64 | 25.9,33.24 26.09,33.24 v26.34,33.74
  other vias: 79,18 26.84,55.58 28.62,55.58 32.43,38.56 32.18,45.42 29.13,44.15 26.34,36.28 28.62,34.5 21.21,45.05 20.03,46.36 26.21,45.95 19.37,33.81 14.61,33.81 10.16,31.59 5.71,33.81 5.4,30.95 21.91,26.63 18.46,26.63 11.86,27.39 16.18,25.36 20.25,26.63 10,12 13,12 37.8,16.17 25.67,13.67 29.48,14.96 34.57,15.96 53.26,27.13 60.84,24.8 57.84,16.99 63.16,37.04 62.16,33.74 50.21,21.8 56.53,22.8 54.53,17.99 45.89,40.6 51.74,49.99 53.51,46.95 38.02,47.96 32.43,53.55 25.57,50.76 44.12,42.37 35.48,24.34 35.48,26.63 42.08,26.37 35.48,20.53 24.56,21.29 29.64,24.34 25.07,27.64 38.78,45.42 34.21,45.68 62.92,47.22 64.14,41.74 50.72,39.58 49.45,32.98 49.45,35.77 54.53,33.48 50.97,30.94 49.7,42.88 22.44,46.29 12.86,17.39 10.36,19.39 14.86,18.89 16.36,16.89 17.86,18.39 24.77,39.22 17.71,40.47 14.52,40.53 15.71,42.03 10.27,39.22 11.59,40.45 21.03,36.64 12.71,36.51 79,51 72,58 1,51 8,58 1,18 8,11 72,11 58.43,53.35
  pour Bottom (isolate 0.254): 0,0 80,0 80,89 0,89
  pour Top (isolate 0.254): 0,0 80,0 80,90 0,90
  pour Top (no thermals): 6.35,32.86 10.48,32.86 10.48,32.54 10.16,32.23 6.67,32.23 6.35,32.54
  pour Top (no thermals): 23.81,33.81 26.04,33.81 26.04,33.18 23.81,33.18
N$1
  Top 0.254: IC1.3 22.75,37.25 20.69,39.31 20.69,41.44 20,42.12 19.21,42.12 X1.2
  Top 0.406: C9.1 18.33,42.51 X1.2
N$2
  Top 0.254: IC1.2 23.5,37.75 21.75,39.5 21.75,41.5 22.38,42.12 24.2,42.12 X1.1
  Top 0.406: C10.1 24.09,42.51 X1.1
N$3
  Top 0.203: IC1.14 23.33,31.75 23.03,31.45 23.03,24.59 R2.2
N$4
  Top 0.203: IC1.6 12.2,35.75 11.68,36.28 R1.2
N$5
  Top 0.508: USB.VUSB 6.42,36.1 4.21,33.89 4.21,28.54 8.9,23.85 IC3.3 16.13,23.85 C15.2
N$6
  Top 0.203: PWR.A R10.1
N$7
  Top 0.203: RN1.8 65.96,40.62 68.73,43.39 JTAG.3
N$8
  Top 0.203: LED.A R11.1
N$9
  Top 0.203: RN1.7 67.61,39.73 68.73,40.85 JTAG.5
N$10
  Top 0.203: RN1.6 68.11,38.93 68.73,38.31 JTAG.7
N$11
  Top 0.203: RN1.5 66.47,38.03 68.73,35.77 JTAG.9
N$12
  Top 0.203: R7.2 67.97,32.47 68.73,33.23 JTAG.11
N$13
  Top 0.203: RN2.8 61.87,30.69 JTAG.13
N$14
  Top 0.203: RN2.7 64.02,29.82 66.19,28.15 JTAG.15
N$15
  Top 0.203: JTAG.17 67.46,25.61 63.55,29.02 RN2.6
N$16
  Top 0.203: RN2.5 63.17,28.12 68.73,23.07 JTAG.19
N$22
  Top 0.406: RLED1.1 19.15,5.2 LED1.A
N$23
  Top 0.406: RLED2.1 29.15,5.2 LED2.A
N$24
  Top 0.406: RLED3.1 39.15,5.2 LED3.A
N$25
  Top 0.406: RLED4.1 49.15,5.2 LED4.A
N$26
  Top 0.406: RLED5.1 59.15,5.2 LED5.A
P18
  Top 0.203: PB.4 PB.3 33.25,16.41 IC4.18
  Top 0.305: PB.4 21.64,16.41 R12.1
P19
  Top 0.203: R11.2 JP2.9 40.84,22.86 IC4.19
P20  (via drill 0.5 pad 0.25)
  Top 0.203: JP2.8 43.38,24.27 IC4.20
  Top 0.254: RLED1.2 v22,8
  Bottom 0.254: v22,8 25,8 28,11 40.88,11 JP2.8
P21  (via drill 0.5 pad 0.25)
  Top 0.203: JP2.7 45.92,25.68 IC4.21
  Top 0.254: RLED2.2 v32,8
  Bottom 0.254: v32,8 37,8 39,10 42.42,10 JP2.7
P22  (via drill 0.5 pad 0.25)
  Top 0.203: IC4.22 47.5,26.13 47.5,18 48.46,17.04 JP2.6
  Top 0.254: RLED3.2 v42,8
  Bottom 0.254: v42,8 42.96,8 JP2.6
P23  (via drill 0.5 pad 0.25)
  Top 0.203: IC4.23 53,26.05 53,20 51,18 JP2.5
  Top 0.254: RLED4.2 v52,8
  Bottom 0.254: v52,8 52,9 51,10 JP2.5
P27  (via drill 0.5 pad 0.25)
  Top 0.203: IC4.27 58,25.58 58,23 53.54,18.54 JP2.4
  Top 0.254: RLED5.2 v62,8
  Bottom 0.254: v62,8 59.04,8 JP2.4
P28
  Top 0.203: IC4.28 59,25.71 59,21.5 56.08,18.58 JP2.3
  Top 0.254: 59,21.54 59,21.5 | SJ1.1 SJ1.2
  Top 0.406: SJ1.1 59,21.5 | SJ1.2 62.86,21.5 X2.3
RTCK1
  Top 0.203: IC4.33 57.9,32.47 R7.1
SK  (via drill 0.51)
  Top 0.203: IC1.62 27.65,45.21 v28.11,45.68 28.5,46.06 IC2.2
  Top 0.254: RN3.3 29.24,50.36 28.5,49.61 IC2.2
  Bottom 0.203: v28.11,45.68 25.83,47.96 22.5,47.96 JP3.4
TCK1
  Top 0.203: RN1.4 58.57,38.03 57.83,37.29 57.83,36.46 IC4.34
TDI1
  Top 0.203: RN1.2 57.7,39.73 IC4.37
TDO1
  Top 0.203: IC4.32 58.52,30.71 RN2.1
TMS1
  Top 0.203: RN1.3 58.03,38.93 IC4.36
TRST1
  Top 0.203: RN1.1 57.46,40.62 IC4.38
TSRST1
  Top 0.203: IC4.31 58.29,29.82 RN2.2
V_TARGET  (via drill 0.51)
  Top 0.305: IC4.26 55.38,27.06 C20.2 | R12.2 21.82,13.65 v22.86,14.69
  Top 0.406: v52.24,30.94 52.24,30.2 IC4.26 | 58.29,43.75 C22.+ | v56.25,43.75 58.29,43.75 | 58.29,43.75 58.48,43.94 D1.C 58.48,48.8 R8.1 58.69,51.13 J1.1
  Bottom 0.406: v56.25,43.75 56.32,43.68 56.32,37.31 52.24,33.23 v52.24,30.94 40.3,19 27.17,19 v22.86,14.69
V_TARGET_UNREG
  Top 0.406: JTAG.2 JTAG.1 72.23,47.24 70.96,48.51 R8.2 | R8.2 61.38,48.66 | R8.2 61.27,48.77 | R8.2 61.53,54.74 JP4.2
VPHY
  Top 0.254: IC1.4 22.25,36.75 21.5,37.5 17.81,37.5 C13.2
  Top 0.406: L2.1 13.9,37.27 15.54,37.27 C11.+ 17.72,37.51 C13.2
VPLL
  Top 0.254: IC1.9 20.75,34.25 20.24,33.74 C14.2 20.13,32.38 C12.+ 16.29,32.38 L1.1

### Text on the board
tNames: Self powered | (1.5-3.3v max) | Target power: | Bus Blaster | CS | SK | DAT | 3V3 | GND | 3V3 | GND | TDO | TDI | TCK | TMS | (1.5-3.3v max) | (3.3V 200mA max) | MAX 3.3V | VTG | VTG | TRST | TDI | TMS | TCK | JER | RTCK | GND | v.trocio | IAN LESNET | TDO | TSRST | DBGRQ | DBGACK | Bus Blaster v3c+ / 44CON Edition / SEPT 10-12 2014 | P19 | P20 | P21 | P22 | P23 | P27 | P28 | GND | 3V3
bNames: Buildable as: / * Standard Bus Blaster / * CPLD LED flasher / * CPLD glitch generator / / Mods: Cool 44CON PCB, 1.8v LDO, / LEDs on P19..P27, & Osc on P28 | Target power: | 3V3 | GND | TDO | TDI | TCK | TMS | Self powered | CS | SK | (1.5-3.3v max) | 3V3 | GND | Bus Blaster | DATA | (3.3V 200mA max) | VTG | VTG | TRST | TDI | TMS | TCK | RTCK | GND | TDO | TSRST | Bus Blaster v3c | DBGRQ | DBGACK | http://dangerousprototypes.com | P19 | P20 | P21 | P22 | P23 | P27 | P28 | GND | 3V3 | Fulfillment by: | Seeed Studio | seeedstudio.com | Files and Build Details: / https://github.com/securelyfitz/44con / Modified by @securelyfitz